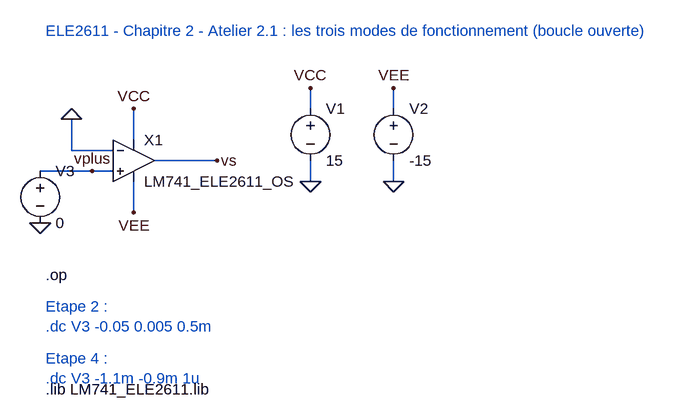
[diagram p0: schematic Ch2_Atelier_2_1_TroisModes.asc]
Ch2_Atelier_2_1_TroisModes.asc, the LTspice schematic file:
Version 4
SHEET 1 1200 900
WIRE 112 176 112 224
WIRE 208 160 208 208
WIRE 480 128 480 160
WIRE 608 128 608 160
WIRE 64 256 144 256
WIRE 144 256 176 256
WIRE 176 224 112 224
WIRE 208 272 208 320
WIRE 240 240 336 240
WIRE 480 240 480 272
WIRE 608 240 608 272
FLAG 112 176 0
FLAG 64 336 0
FLAG 144 256 vplus
FLAG 208 160 VCC
FLAG 208 320 VEE
FLAG 336 240 vs
FLAG 480 128 VCC
FLAG 480 272 0
FLAG 608 128 VEE
FLAG 608 272 0
SYMBOL voltage 64 240 R0
SYMATTR InstName V3
SYMATTR Value 0
SYMBOL Opamps\\opamp2 208 176 R0
SYMATTR InstName X1
SYMATTR Value LM741_ELE2611_OS
SYMBOL voltage 480 144 R0
SYMATTR InstName V1
SYMATTR Value 15
SYMBOL voltage 608 144 R0
SYMATTR InstName V2
SYMATTR Value -15
TEXT 72 40 Left 2 ;ELE2611 - Chapitre 2 - Atelier 2.1 : les trois modes de fonctionnement (boucle ouverte)
TEXT 72 416 Left 2 !.op
TEXT 72 464 Left 2 ;Etape 2 :\n.dc V3 -0.05 0.005 0.5m
TEXT 72 544 Left 2 ;Etape 4 :\n.dc V3 -1.1m -0.9m 1u
TEXT 72 592 Left 2 !.lib LM741_ELE2611.lib

The netlist it stands for:
* Ch2_Atelier_2_1_TroisModes.asc
V3 vplus 0 0
XX1 vplus 0 VCC VEE vs LM741_ELE2611_OS  ; pins In+ In- V+ V- OUT
V1 VCC 0 15
V2 VEE 0 -15
* ELE2611 - Chapitre 2 - Atelier 2.1 : les trois modes de fonctionnement (boucle ouverte)
.op
* Etape 2 :
* .dc V3 -0.05 0.005 0.5m
* Etape 4 :
* .dc V3 -1.1m -0.9m 1u
.lib LM741_ELE2611.lib
.backanno
.end